# EAGLE schematic Proto-Pi (EAGLE 9.6.2)

## Sheet 1 of 2: Connectors
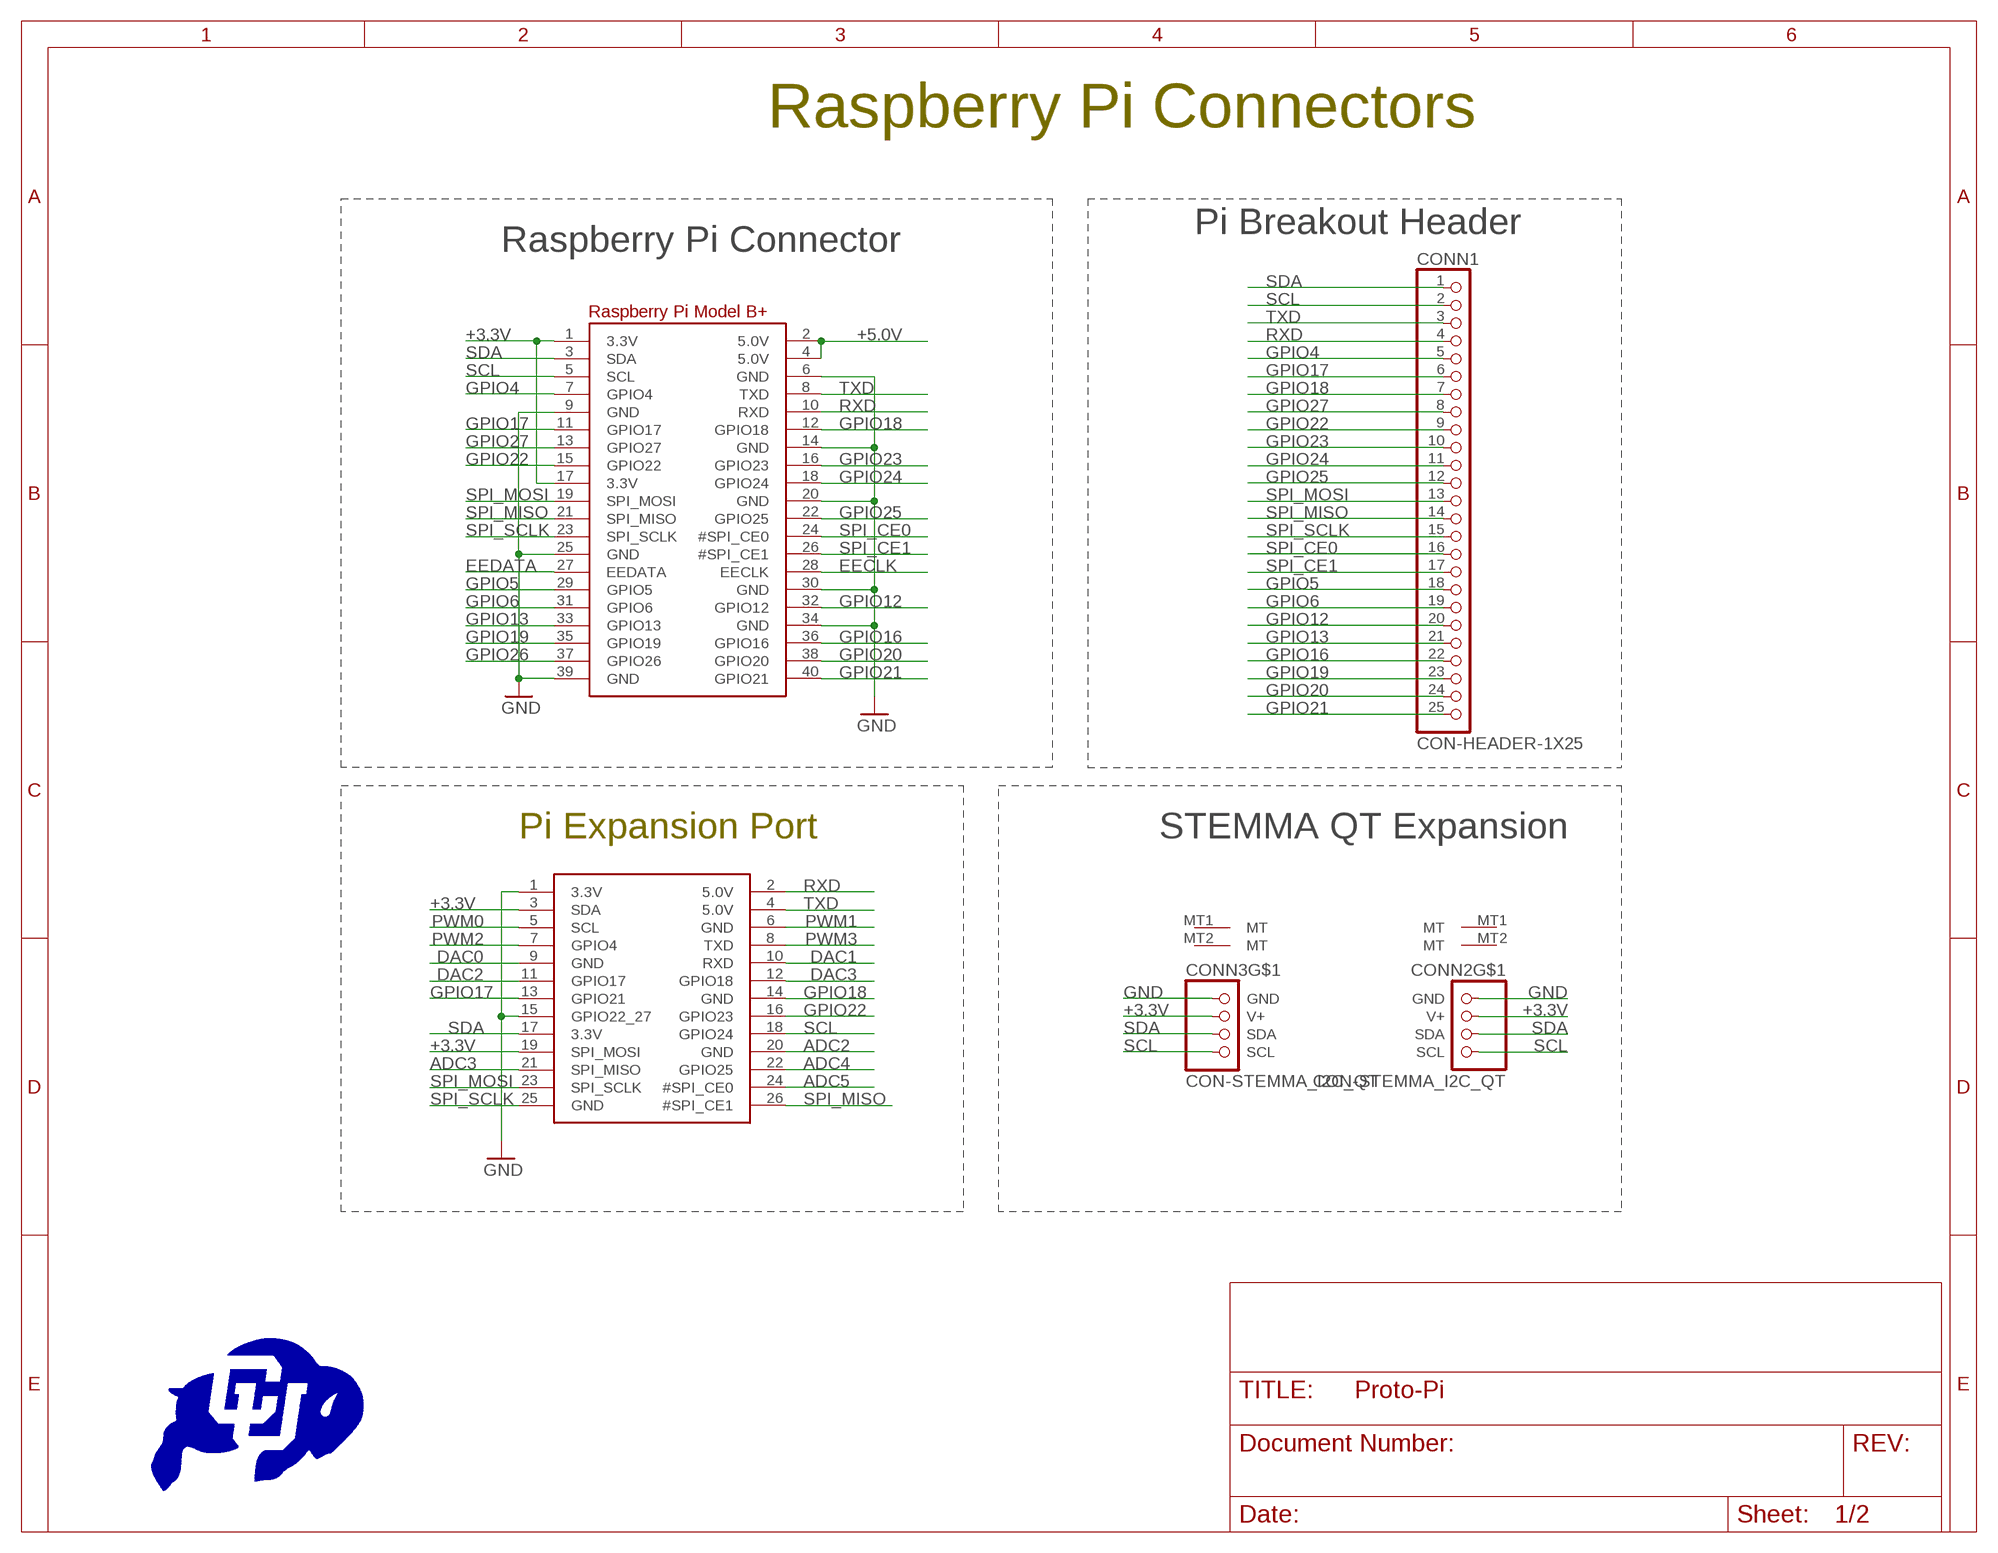
[diagram p0: schematic, sheet 1]

### Parts
CONN1  CON-HEADER-1X25  [1X25_ROUND_70MIL]
CONN2  CON-STEMMA_I2C_QT  [JST_SH4]
CONN3  CON-STEMMA_I2C_QT  [JST_SH4]
JP1  CON-RASBERRYPI_IDC  [RASBERRYPI_IDC]
P1  ART-CU-LOGO  [CU_LOGO]
RPI1  BRD-RASPBERRYPI_BPLUS_BONNETNODIM  [PI_BONNET_NODIM]

### Nets
+3.3V: CONN2.2(V+) CONN3.2(V+) JP1.3(SDA) JP1.19(SPI_MOSI) RPI1.1(3.3V) RPI1.17(3.3V) ; also sheet 2
+5.0V: RPI1.2(5.0V) RPI1.4(5.0V)
ADC2: JP1.20(GND) ; also sheet 2
ADC3: JP1.21(SPI_MISO) ; also sheet 2
ADC4: JP1.22(GPIO25) ; also sheet 2
ADC5: JP1.24(#SPI_CE0) ; also sheet 2
DAC0: JP1.9(GND) ; also sheet 2
DAC1: JP1.10(RXD) ; also sheet 2
DAC2: JP1.11(GPIO17) ; also sheet 2
DAC3: JP1.12(GPIO18) ; also sheet 2
EECLK: RPI1.28(EECLK)
EEDATA: RPI1.27(EEDATA)
GND: CONN2.1(GND) CONN3.1(GND) JP1.1(3.3V) JP1.15(GPIO22_27) RPI1.6(GND) RPI1.9(GND) RPI1.14(GND) RPI1.20(GND) RPI1.25(GND) RPI1.30(GND) RPI1.34(GND) RPI1.39(GND) ; also sheet 2
GPIO4: CONN1.5 RPI1.7(GPIO4)
GPIO5: CONN1.18 RPI1.29(GPIO5)
GPIO6: CONN1.19 RPI1.31(GPIO6)
GPIO12: CONN1.20 RPI1.32(GPIO12)
GPIO13: CONN1.21 RPI1.33(GPIO13)
GPIO16: CONN1.22 RPI1.36(GPIO16)
GPIO17: CONN1.6 JP1.13(GPIO21) RPI1.11(GPIO17)
GPIO18: CONN1.7 JP1.14(GND) RPI1.12(GPIO18)
GPIO19: CONN1.23 RPI1.35(GPIO19)
GPIO20: CONN1.24 RPI1.38(GPIO20)
GPIO21: CONN1.25 RPI1.40(GPIO21)
GPIO22: CONN1.9 JP1.16(GPIO23) RPI1.15(GPIO22)
GPIO23: CONN1.10 RPI1.16(GPIO23)
GPIO24: CONN1.11 RPI1.18(GPIO24)
GPIO25: CONN1.12 RPI1.22(GPIO25)
GPIO26: RPI1.37(GPIO26)
GPIO27: CONN1.8 RPI1.13(GPIO27)
PWM0: JP1.5(SCL) ; also sheet 2
PWM1: JP1.6(GND) ; also sheet 2
PWM2: JP1.7(GPIO4) ; also sheet 2
PWM3: JP1.8(TXD) ; also sheet 2
RXD: CONN1.4 JP1.2(5.0V) RPI1.10(RXD)
SCL: CONN1.2 CONN2.4(SCL) CONN3.4(SCL) JP1.18(GPIO24) RPI1.5(SCL) ; also sheet 2
SDA: CONN1.1 CONN2.3(SDA) CONN3.3(SDA) JP1.17(3.3V) RPI1.3(SDA) ; also sheet 2
SPI_CE0: CONN1.16 RPI1.24(#SPI_CE0) ; also sheet 2
SPI_CE1: CONN1.17 RPI1.26(#SPI_CE1)
SPI_MISO: CONN1.14 JP1.26(#SPI_CE1) RPI1.21(SPI_MISO) ; also sheet 2
SPI_MOSI: CONN1.13 JP1.23(SPI_SCLK) RPI1.19(SPI_MOSI) ; also sheet 2
SPI_SCLK: CONN1.15 JP1.25(GND) RPI1.23(SPI_SCLK) ; also sheet 2
TXD: CONN1.3 JP1.4(5.0V) RPI1.8(TXD)
Unconnected: CONN2.MT1(MT) CONN2.MT2(MT) CONN3.MT1(MT) CONN3.MT2(MT)

### Notes on the sheet
- Raspberry Pi Connectors
- Pi Breakout Header
- Raspberry Pi Connector
- Pi Expansion Port | STEMMA QT Expansion

## Sheet 2 of 2: Data Conversion
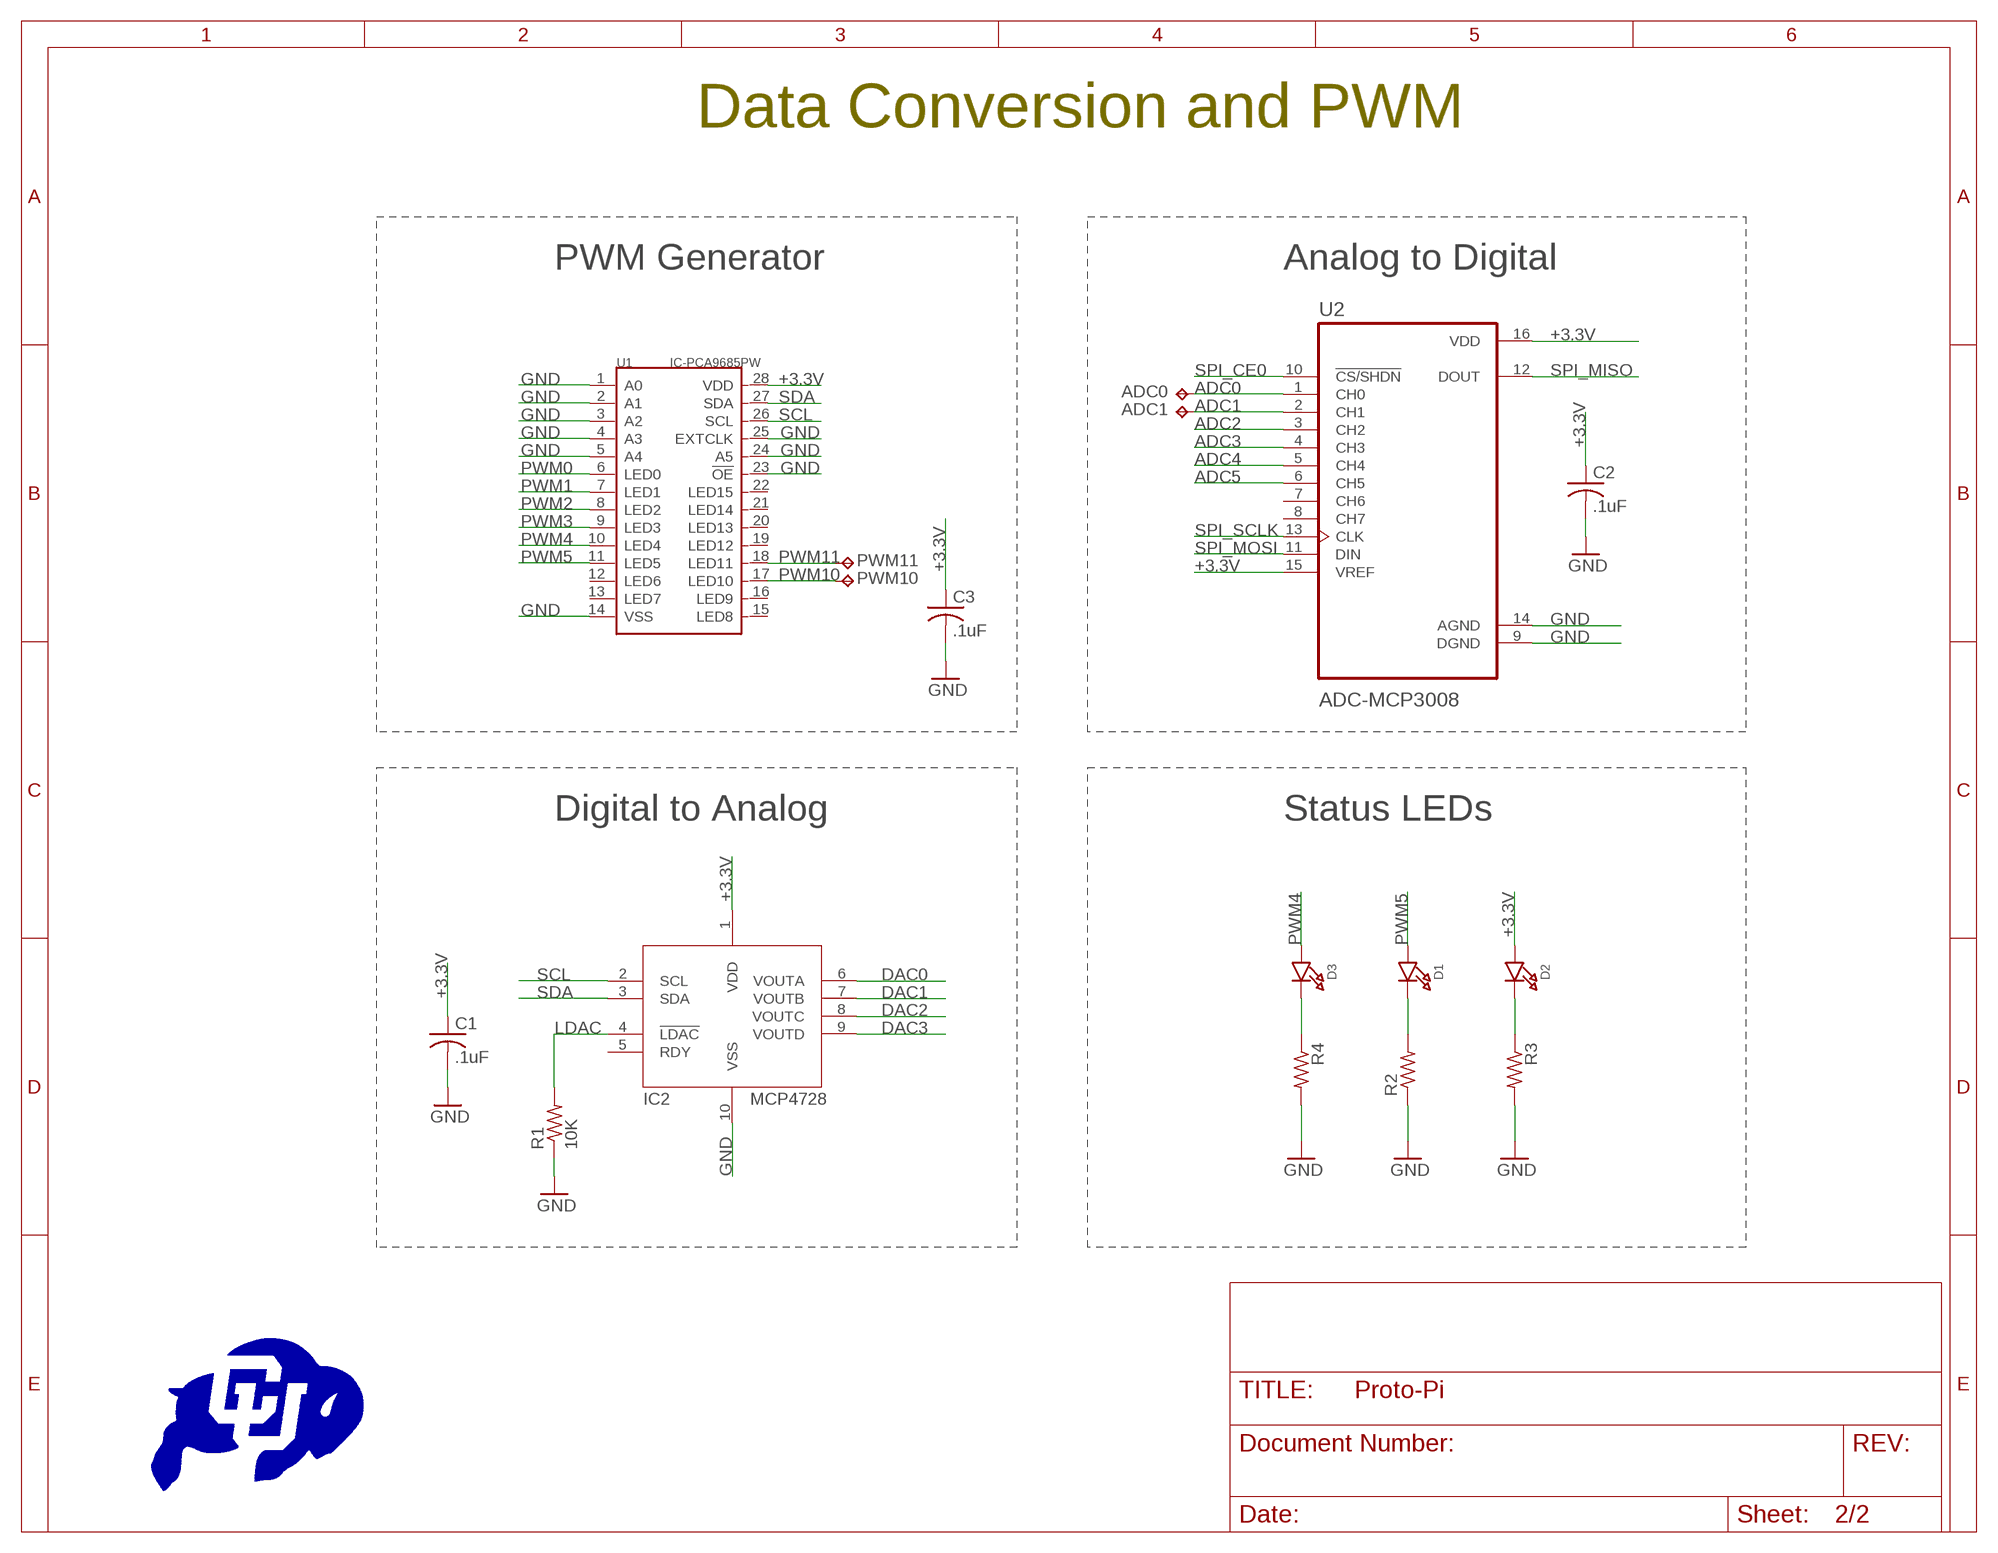
[diagram p1: schematic, sheet 2]

### Parts
ADC0  TPTP20R  [TP20R]
ADC1  TPTP20R  [TP20R]
C1  .1uF  C-USC0603  [C0603]
C2  .1uF  C-USC0603  [C0603]
C3  .1uF  C-USC0603  [C0603]
D1  LED-SMA0603_NOOUTLINE  [CHIPLED_0603_NOOUTLINE]
D2  LED-SMA0603_NOOUTLINE  [CHIPLED_0603_NOOUTLINE]
D3  LED-SMA0603_NOOUTLINE  [CHIPLED_0603_NOOUTLINE]
IC2  DAC-MCP4728  [MSOP10]
P2  ART-CU-LOGO  [CU_LOGO]
PWM10  TPTP20R  [TP20R]
PWM11  TPTP20R  [TP20R]
R1  10K  R-US_R0603  [R0603]
R2  R-US_R0402  [R0402]
R3  R-US_R0402  [R0402]
R4  R-US_R0402  [R0402]
U1  IC-PCA9685PW  [TSSOP28-0.65-9.7X4.4MM]
U2  ADC-MCP3008  [SOIC127P600X175-16N]

### Nets
+3.3V: C1.1 C2.1 C3.1 D2.A IC2.1(VDD) U1.28(VDD) U2.15(VREF) U2.16(VDD) ; also sheet 1
ADC0: ADC0.TP U2.1(CH0)
ADC1: ADC1.TP U2.2(CH1)
ADC2: U2.3(CH2) ; also sheet 1
ADC3: U2.4(CH3) ; also sheet 1
ADC4: U2.5(CH4) ; also sheet 1
ADC5: U2.6(CH5) ; also sheet 1
DAC0: IC2.6(VOUTA) ; also sheet 1
DAC1: IC2.7(VOUTB) ; also sheet 1
DAC2: IC2.8(VOUTC) ; also sheet 1
DAC3: IC2.9(VOUTD) ; also sheet 1
GND: C1.2 C2.2 C3.2 IC2.10(VSS) R1.1 R2.1 R3.2 R4.2 U1.1(A0) U1.2(A1) U1.3(A2) U1.4(A3) U1.5(A4) U1.14(VSS) U1.23(!OE) U1.24(A5) U1.25(EXTCLK) U2.9(DGND) U2.14(AGND) ; also sheet 1
LDAC: IC2.4(!LDAC) R1.2
N$1: D1.C R2.2
N$2: D2.C R3.1
N$3: D3.C R4.1
PWM0: U1.6(LED0) ; also sheet 1
PWM1: U1.7(LED1) ; also sheet 1
PWM2: U1.8(LED2) ; also sheet 1
PWM3: U1.9(LED3) ; also sheet 1
PWM4: D3.A U1.10(LED4)
PWM5: D1.A U1.11(LED5)
PWM10: PWM10.TP U1.17(LED10)
PWM11: PWM11.TP U1.18(LED11)
SCL: IC2.2(SCL) U1.26(SCL) ; also sheet 1
SDA: IC2.3(SDA) U1.27(SDA) ; also sheet 1
SPI_CE0: U2.10(!CS/SHDN) ; also sheet 1
SPI_MISO: U2.12(DOUT) ; also sheet 1
SPI_MOSI: U2.11(DIN) ; also sheet 1
SPI_SCLK: U2.13(CLK) ; also sheet 1
Unconnected: IC2.5(RDY) U1.12(LED6) U1.13(LED7) U1.15(LED8) U1.16(LED9) U1.19(LED12) U1.20(LED13) U1.21(LED14) U1.22(LED15) U2.7(CH6) U2.8(CH7)

### Notes on the sheet
- Data Conversion and PWM
- PWM Generator | Analog to Digital
- Digital to Analog | Status LEDs

## Library data of the parts
ADC0 ADC1 PWM10 PWM11 = testpad:TP: Test pad
C1-C3 = RLC:C-US: CAPACITOR, American symbol; ARROW_PN: ?; DATASHEET: ?; DESCRIPTION: ?; DIGI-KEY_PN: ?; MANUFACTURER: ?; MOUSER_PN: ?; PACKAGE: ?; PART_NUMBER: ?; SPICEPREFIX: C; TEMP_HIGH: ?; TEMP_LOW: ?; TOLERANCE: ?; TYPE: ?; WEIGHT_MG: 4.7
CONN1 = raspi:CON-HEADER-1X25
CONN2 CONN3 = raspi:CON-STEMMA_I2C
D1-D3 = raspi:LED-SMA: LED 0603 - 0603 Surface Mount Package 2mA: Green LED - Low Power (3.9mcd, 2ma, 1.7Vf) - Digikey: 475-2709-2-ND Orange LED - Low Power (9.8mcd, 2ma, 1.8Vf) - Digikey: 475-1194-2-ND Red LED - Low Power (5mcd, 2ma, 1.8Vf) - Digikey: 475-1195-2-ND Yellow LED - Low Power (7mcd, 2ma, 1.8Vf) - Digikey: 475-1196-2-ND 5mA: Blue LED - Low Power (17mcd, 5ma, 2.9Vf) - Digikey: LNJ937W8CRACT-ND 0805 - 0805 Surface Mount Package 2mA: Red LED (8.8mcd, 2mA, 1.8Vf, Clear) - Low Power [Digikey: 475-2510-1-ND] Green LED (5mcd, 2mA, 1.8Vf, Clear) - Low Power [Digikey: 475-2730-1-ND] Yellow LED (11.3mcd, 2mA, 1.8Vf, Clear) - Low Power [Digikey: 475-2555-1-ND] 20mA: Red LED (104mcd, 20mA, Diffused) - LS R976 [Digikey: 475-1278-6-ND] Red LED (12mcd, 20mA, 2.0Vf, Clear) - APT2012EC [Digikey: 754-1128-1-ND] Green LED (15mcd, 20mA, 2.2Vf, Clear) - APT2012GC [Digikey: 754-1131-1-ND] Orange LED (160mcd, 20mA, 2.1Vf, Clear) - APT2012SECK [Digikey: 754-1130-1-ND] 1206 - 1206 Surface Mount Package Green LED (26mcd, 20mA, Diffused) - LG N971 [Digikey: 475-1407-6-ND] Red LED (15mcd, 20mA, Diffused) - LH N974 [Digikey: 475-1416-6-ND] Cree - Cree High-Power Surface Mount LEDs XPEBWT-L1-0000-00D50 - White 111lm 350mA 2.9Vf 6200K 110° XTEAWT-00-0000-00000LEE3 - White 114lm 350mA 2.85Vf 5000K 115° Everlight - Everlight 45-21 Series Surface Mount LEDs 45-21/QK2C-B2832AC2CB2/2T - Warm White 2000mcd 20mA 3.25Vf 3050K 120° 45-21/LK2C-B38452C4CB2/2T - Nuetral White 2000mcd 20mA 3.25Vf 4150K 120° 45-21/LK2C-B50634C6CB2/2T - Cold White 2200mcd 20mA 3.25Vf 5650K 120° PLCC2 Reverse Mount LS T77K-J1L2-1-0-2-R18-Z - Red 11.25mcd 2mA 1.8Vf 630nm 120° LO T77K-L1M2-24-Z - Orange 19.6mcd 2mA 1.8Vf 606nm 120° LY T77K-K2M1-26-Z - Yellow 15.7mcd 2mA 1.8Vf 587nm 120°
IC2 = raspi:DAC-MCP4728; ARROW_PN: ?; DATASHEET: ?; DESCRIPTION: ?; DIGI-KEY_PN: ?; MANUFACTURER: ?; MOUSER_PN: ?; PACKAGE: ?; PART_NUMBER: ?; TEMP_HIGH: ?; TEMP_LOW: ?; TOLERANCE: ?; TYPE: ?; WEIGHT_MG: ?
JP1 = raspi:CON-RASBERRYPI_IDC: Rasberry PI IDC Header
P1 P2 = AIMRL:ART-CU-LOGO
R1 = RLC:R-US_: RESISTOR, American symbol; ARROW_PN: ?; DATASHEET: ?; DESCRIPTION: ?; DIGI-KEY_PN: ?; MANUFACTURER: ?; MOUSER_PN: ?; PACKAGE: ?; PART_NUMBER: ?; SPICEPREFIX: R; TEMP_HIGH: ?; TEMP_LOW: ?; TOLERANCE: ?; TYPE: ?; WEIGHT_MG: 2
R2-R4 = RLC:R-US_: RESISTOR, American symbol; ARROW_PN: ?; DATASHEET: ?; DESCRIPTION: ?; DIGI-KEY_PN: ?; MANUFACTURER: ?; MOUSER_PN: ?; PACKAGE: ?; PART_NUMBER: ?; SPICEPREFIX: R; TEMP_HIGH: ?; TEMP_LOW: ?; TOLERANCE: ?; TYPE: ?; WEIGHT_MG: .8
RPI1 = raspi:BRD-RASPBERRYPI_BPLUS
U1 = raspi:IC-PCA9685PW: 310030252 Check prices <https://pricing.snapeda.com/parts/PCA9685PW/NXP%20USA/view-part?ref=eda>; ARROW_PN: ?; DATASHEET: ?; DESCRIPTION: ?; DIGI-KEY_PN: ?; MANUFACTURER: ?; MOUSER_PN: ?; PACKAGE: ?; PART_NUMBER: ?; TEMP_HIGH: ?; TEMP_LOW: ?; TOLERANCE: ?; TYPE: ?; WEIGHT_MG: ?
U2 = raspi:ADC-MCP3008: Check prices <https://pricing.snapeda.com/parts/MCP3008-I/SL/Microchip%20Technology/view-part?ref=eda>; ARROW_PN: ?; DATASHEET: ?; DESCRIPTION: ?; DIGI-KEY_PN: ?; MANUFACTURER: ?; MOUSER_PN: ?; PACKAGE: ?; PART_NUMBER: ?; TEMP_HIGH: ?; TEMP_LOW: ?; TOLERANCE: ?; TYPE: ?; WEIGHT_MG: ?